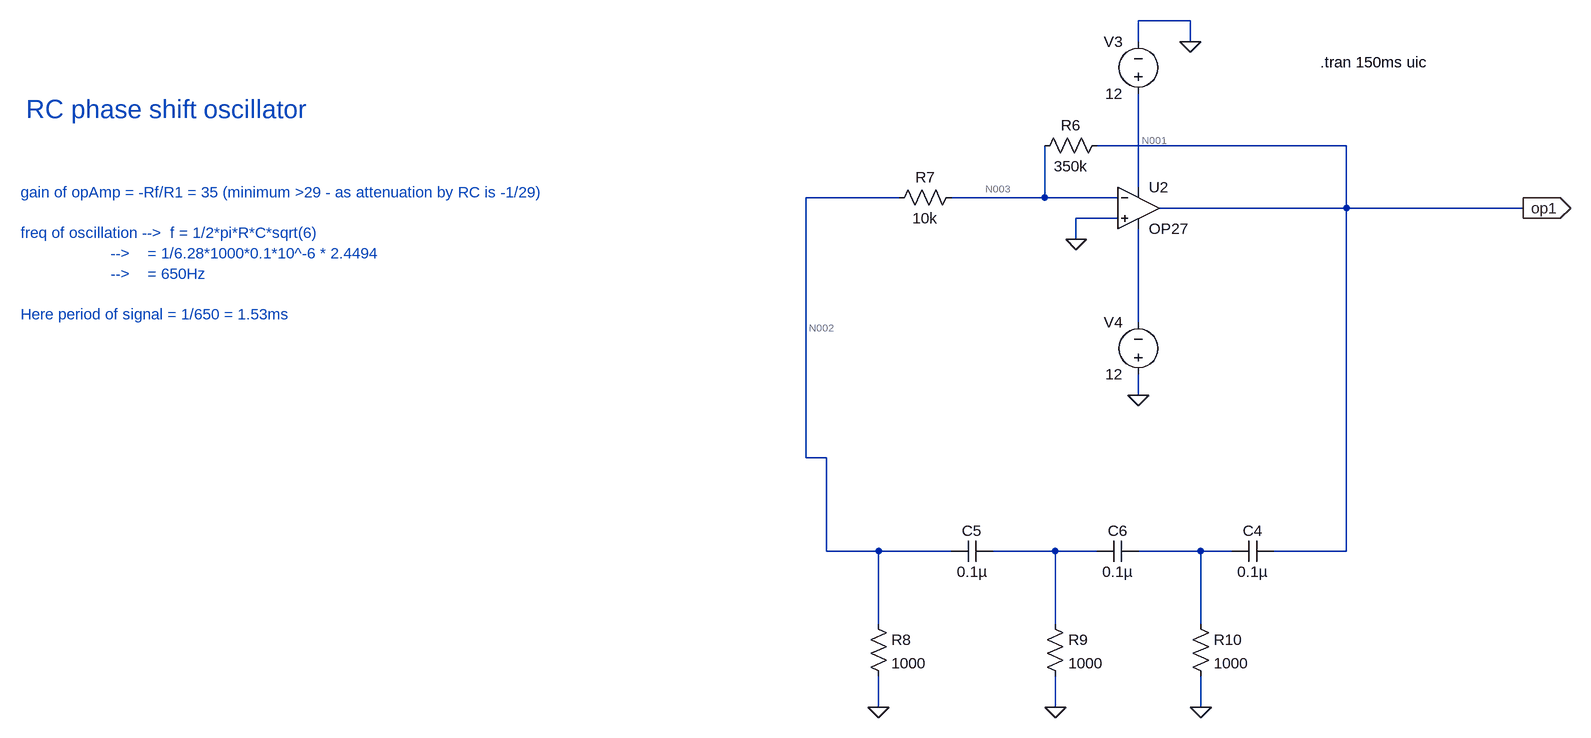
[diagram p0: schematic RC_phase_shift_oscillator.asc]
RC_phase_shift_oscillator.asc, the LTspice schematic file:
Version 4.1
SHEET 1 1656 2340
WIRE 288 784 208 784
WIRE 208 816 208 784
WIRE 288 816 288 784
WIRE 528 976 144 976
WIRE 208 1040 208 896
WIRE -160 1056 -304 1056
WIRE 64 1056 64 976
WIRE 64 1056 -80 1056
WIRE 176 1056 64 1056
WIRE 528 1072 528 976
WIRE 528 1072 240 1072
WIRE 800 1072 528 1072
WIRE 176 1088 112 1088
WIRE 112 1120 112 1088
WIRE 208 1248 208 1104
WIRE 208 1360 208 1328
WIRE -304 1456 -304 1056
WIRE -272 1456 -304 1456
WIRE -272 1600 -272 1456
WIRE -192 1600 -272 1600
WIRE -80 1600 -192 1600
WIRE 80 1600 -16 1600
WIRE 144 1600 80 1600
WIRE 304 1600 208 1600
WIRE 352 1600 304 1600
WIRE 528 1600 528 1072
WIRE 528 1600 416 1600
WIRE -192 1712 -192 1600
WIRE 80 1712 80 1600
WIRE 304 1712 304 1600
WIRE -192 1840 -192 1792
WIRE 80 1840 80 1792
WIRE 304 1840 304 1792
FLAG 112 1120 0
FLAG 208 1360 0
FLAG -192 1840 0
FLAG 80 1840 0
FLAG 304 1840 0
FLAG 288 816 0
FLAG 800 1072 op1
IOPIN 800 1072 Out
SYMBOL OpAmps\\OP27 208 1008 R0
SYMATTR InstName U2
SYMBOL voltage 208 912 R180
WINDOW 0 24 96 Left 2
WINDOW 3 24 16 Left 2
WINDOW 123 0 0 Left 0
WINDOW 39 0 0 Left 0
SYMATTR InstName V3
SYMATTR Value 12
SYMBOL voltage 208 1344 R180
WINDOW 0 24 96 Left 2
WINDOW 3 24 16 Left 2
WINDOW 123 0 0 Left 0
WINDOW 39 0 0 Left 0
SYMATTR InstName V4
SYMATTR Value 12
SYMBOL res 160 960 R90
WINDOW 0 0 56 VBottom 2
WINDOW 3 32 56 VTop 2
SYMATTR InstName R6
SYMATTR Value 350k
SYMBOL res -64 1040 R90
WINDOW 0 0 56 VBottom 2
WINDOW 3 32 56 VTop 2
SYMATTR InstName R7
SYMATTR Value 10k
SYMBOL cap 416 1584 R90
WINDOW 0 0 32 VBottom 2
WINDOW 3 32 32 VTop 2
SYMATTR InstName C4
SYMATTR Value 0.1µ
SYMBOL cap -16 1584 R90
WINDOW 0 0 32 VBottom 2
WINDOW 3 32 32 VTop 2
SYMATTR InstName C5
SYMATTR Value 0.1µ
SYMBOL cap 208 1584 R90
WINDOW 0 0 32 VBottom 2
WINDOW 3 32 32 VTop 2
SYMATTR InstName C6
SYMATTR Value 0.1µ
SYMBOL res -208 1696 R0
SYMATTR InstName R8
SYMATTR Value 1000
SYMBOL res 64 1696 R0
SYMATTR InstName R9
SYMATTR Value 1000
SYMBOL res 288 1696 R0
SYMATTR InstName R10
SYMATTR Value 1000
TEXT 488 848 Left 2 !.tran 150ms uic
TEXT -1504 920 Left 4 ;RC phase shift oscillator
TEXT -1512 1048 Left 2 ;gain of opAmp = -Rf/R1 = 35 (minimum >29 - as attenuation by RC is -1/29)\n \nfreq of oscillation -->  f = 1/2*pi*R*C*sqrt(6)\n                    -->    = 1/6.28*1000*0.1*10^-6 * 2.4494\n                    -->    = 650Hz\n \nHere period of signal = 1/650 = 1.53ms

The netlist it stands for:
* RC_phase_shift_oscillator.asc
X§U2 0 N003 N001 N004 op1 OP27  ; pins In+ In- V+ V- OUT
V3 N001 0 12
V4 0 N004 12
R6 op1 N003 350k
R7 N003 N002 10k
C4 op1 N006 0.1µ
C5 N005 N002 0.1µ
C6 N006 N005 0.1µ
R8 N002 0 1000
R9 N005 0 1000
R10 N006 0 1000
.tran 150ms uic
* RC phase shift oscillator
* gain of opAmp = -Rf/R1 = 35 (minimum >29 - as attenuation by RC is -1/29)
* freq of oscillation -->  f = 1/2*pi*R*C*sqrt(6)
*                     -->    = 1/6.28*1000*0.1*10^-6 * 2.4494
*                     -->    = 650Hz
* Here period of signal = 1/650 = 1.53ms
.lib ADI.lib
.backanno
.end

* Results of the author's LTspice run, read from the files saved beside the schematic
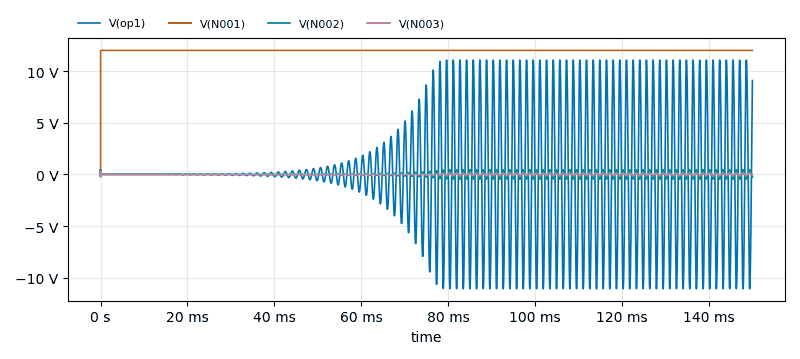
[diagram p1: Transient Analysis of RC_phase_shift_oscillator.asc, plotted from the saved traces]
* Transient Analysis, 1 run:
*   V(op1): min -11.06 V, max 11.06 V, average -10.78 mV, rms 5.643 V, last 9.083 V
*   V(N001): min 0 V, max 12 V, average 12 V, rms 12 V, last 12 V
*   V(N002): min -464.7 mV, max 465.3 mV, average 364.4 µV, rms 184.6 mV, last -260.1 mV
*   V(N003): min -164.9 mV, max 314.4 mV, average 54.74 µV, rms 32.2 mV, last -590.2 µV